# Altium schematic sheet Regulador5V.SchDoc: Sanhaço - Regulador 5v
size A4; DocumentNumber: CB02; Revision: 1.1; SheetNumber: 2; SheetTotal: 4; ProjectName: Sanhaço
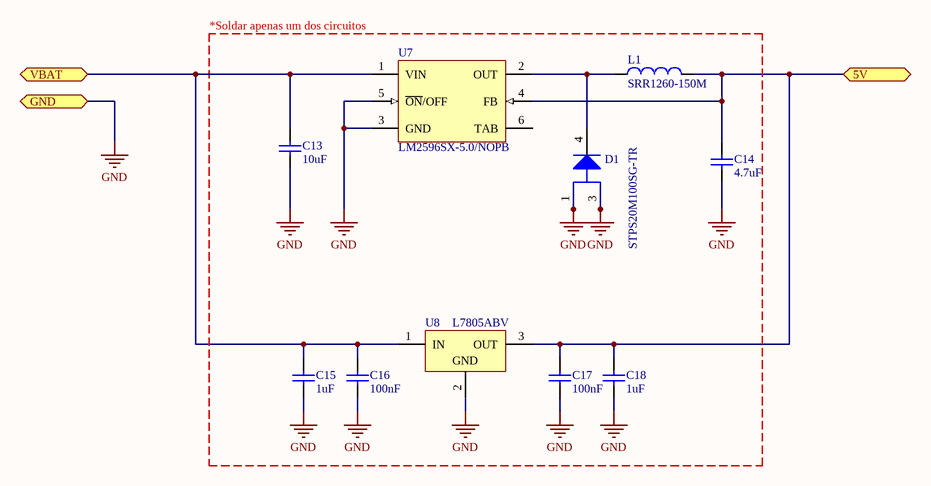
[diagram p0: Regulador5V.SchDoc]

## Parts
C13  10uF  [CAPC1206(3216)190_N]
C14  4.7uF  [CAPC0805(2012)145_N]
C15  1uF  [CAPC0805(2012)145_L]
C16  100nF  [CAPC0805(2012)145_N]
C17  100nF  [CAPC0805(2012)145_N]
C18  1uF  [CAPC0805(2012)145_L]
D1  STPS20M100SG-TR  [ONSC-D2PAK-3-418B-04_J_V]
L1  SRR1260-150M  [BOUR-SRR1260_V]
U7  LM2596SX-5.0/NOPB  [TS5B_M]
U8  L7805ABV  [TO220]

## Blocks framed on the sheet
*Soldar apenas um dos circuitos: C13-C18 D1 L1 U7 U8

## Ports
5V, GND, VBAT

## Nets
GND: C13.1 C14.1 C15.1 C16.1 C17.1 C18.1 D1.1(A) D1.3(A) U7.3(GND) U7.5(~{ON}/OFF) U8.2(GND) ; port GND
5V: C14.2 C17.2 C18.2 L1.2 U7.4(FB) U8.3(OUT) ; port 5V
VBAT: C13.2 C15.2 C16.2 U7.1(VIN) U8.1(IN) ; port VBAT
NetD1_4: D1.4(K) L1.1 U7.2(OUT)

Not connected (* = marked no-connect by the designer): U7 6(TAB)

## Notes on the sheet
- Title
- Size:
- Date:
- A4
- Number:
- Time:
- Revision:
- Sheet
- of
- File:

## Library data of the parts
C13 = CMP-1037-04983-1: CAP 10uF 50V ±20% 1206 (3216 Metric) Thickness 1.9mm SMD; Tolerance: Â±20%; Case-Metric: 3216; Case-EIA: 1206; Technology: SMT; Max Thickness: 1.9 mm; Rated Voltage: 50 V; Value: 10uF
C14 = CMP-1036-04896-1: CAP 4.7uF 25V ±20% 0805 (2012 Metric) Thickness 1.45mm SMD; Case-Metric: 2012; Tolerance: Â±20%; Case-EIA: 0805; Value: 4.7uF; Max Thickness: 1.45 mm; Technology: SMT; Rated Voltage: 25 V
C15 C18 = CMP-1036-04761-1: CAP 1uF 50V ±10% 0805 (2012 Metric) Thickness 1.45mm SMD; Tolerance: Â±10%; Case-EIA: 0805; Case-Metric: 2012; Technology: SMT; Value: 1uF; Max Thickness: 1.45 mm; Rated Voltage: 50 V
C16 C17 = CMP-1036-04417-1: CAP 100nF 50V ±5% 0805 (2012 Metric) Thickness 1.45mm SMD; Case-Metric: 2012; Tolerance: Â±5%; Case-EIA: 0805; Max Thickness: 1.45 mm; Rated Voltage: 50 V; Value: 100nF; Technology: SMT
D1 = CMP-1055-00080-1: SWITCHMODE(TM) Power Rectifier ORing Function Diode, 3-Pin D2PAK, Tape and Reel; Manufacturer: On Semiconductor; Configuration: Single; IFSM Max (A): 150; Voltagem: 455mV; PartNumber: STPS20M100SG-TR; PackageReference: D2PAK-3-418B-04_J; DatasheetVersion: Rev. 6; ComponentLink2URL: http://www.onsemi.cn/pub_link/Collateral/MBRB2515L-D.PDF; RoHS: FALSE; ComponentLink2Description: Datasheet; PackageDescription: 3-Pin D2PAK, Body 9.145 x 9.97 mm, Pitch 2.54 mm; ComponentLink1URL: http://www.onsemi.com/; Mounting Technology: Surface Mount; ComponentLink3Description: Package Specification; Packing: Tape and Reel; PackageVersion: Rev. J, 08/2004; ComponentLink1Description: Manufacturer URL; ComponentLink3URL: http://www.onsemi.com/pub_link/Collateral/BUB323Z-D.PDF
L1 = CMP-2000-07146-1: Shielded Power Inductor, 15 uH, +/- 20%, -40 to 125 degC, 2-Pin SMD, RoHS, Tape and Reel; Manufacturer: Bourns; Core Material: Ferrite; Inductance: 15uH; Product Height: 6.5mm; Maximum DC Current: 5A; Maximum DC Resistance: 27mOhm; Minimum Quality Factor: 25(Typ)@2.52MHz; Package Reference: SRR1260; Package Description: 2-Pin Surface Mount Device, Body 12.5 x 12.5 mm; Datasheet URL: http://www.bourns.com/docs/Product-Datasheets/SRR1260.pdf; Mounting Technology: SurfaceMount; Category: InductorSurfaceMount; Package/Case: 12.8X12.8X6.5; Manufacturer URL: http://www.bourns.com/; Datasheet Version: 03/2015; Tolerance: 20%; Type: Power
U7 = CMP-0069-00282-2: SIMPLE SWITCHER® Power Converter 150 KHz 3A Step-Down Voltage Regulator, 5-pin TO-263; Manufacturer: Texas Instruments; PowerWise: N; PackageTopMarking: NSUZXYTTE#*LM2596S*-5.0 P+; RevisionNote: Component URLs added; ComponentLink3URL: http://www.national.com/packaging/folders/ts5b.html; Code_JEDEC: MO-169-AB; ComponentLink1Description: LM2596 Datasheet; DatasheetVersion: May-2002; ComponentLink2Description: LM2596 Web Page; PackageReference: TS5B; PackageDescription: TO-263, Molded, .400 x .390 x .180in, 5 Lead, .067in Pitch, Surface Mount; CompType: Switcher; ComponentLink1URL: http://www.national.com/ds/LM/LM2596.pdf; ComponentLink3Description: TS5B Package Page; PinCount: 5; RoHS: N; ComponentLink2URL: http://www.national.com/pf/LM/LM2596.html
U8 = CMP-0244-00485-1: Positive Voltage Regulator, 5V, 3-Pin TO-220; ComponentLink1URL: http://www.st.com; PackageDescription: TO, Thru-Hole, Vertical, Heatsink Mounted; 3 In-Line Leads; Pitch 2.54 mm; DatasheetVersion: 16/11/2011; ComponentLink2Description: Datasheet; ComponentLink1Description: Manufacturer URL; PackageReference: TO220; ComponentLink3Description: Package Specification; ComponentLink2URL: http://www.st.com/internet/com/TECHNICAL_RESOURCES/TECHNICAL_LITERATURE/DATASHEET/CD00000444.pdf; ComponentLink3URL: http://www.st.com/internet/com/TECHNICAL_RESOURCES/TECHNICAL_LITERATURE/PACKAGE_INFORMATION/CD00004649.pdf; PackageVersion: ver3.0